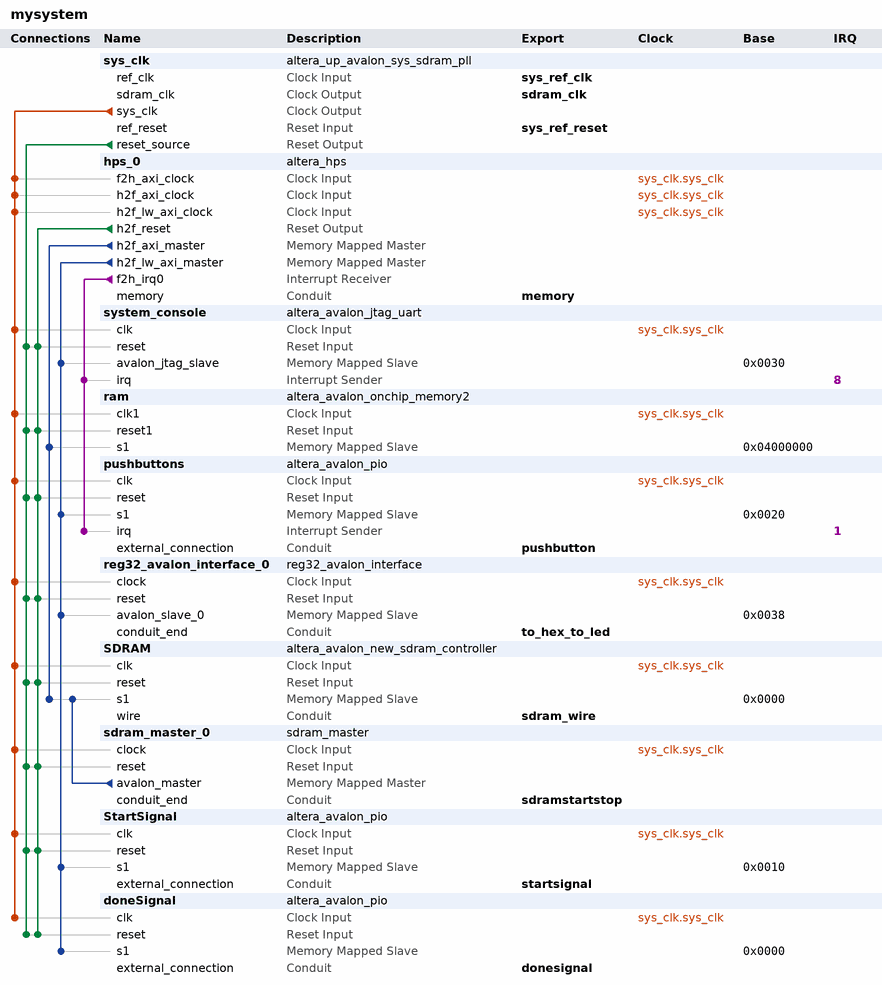
[diagram p0: system contents]
# Platform Designer (Qsys) system mysystem, Cyclone V 5CSEMA5F31C6
# Parameters at their usual value, and those the tool derives, are not listed.
package require -exact qsys 15.0
create_system mysystem
set_project_property DEVICE_FAMILY {Cyclone V}
set_project_property DEVICE 5CSEMA5F31C6

add_instance sys_clk altera_up_avalon_sys_sdram_pll 15.0
set_instance_parameter_value sys_clk CV_boards DE1-SoC
set_instance_parameter_value sys_clk gui_outclk 50.0
set_instance_parameter_value sys_clk gui_refclk 50.0

add_instance hps_0 altera_hps 15.0
set_instance_parameter_value hps_0 EMAC1_Mode N/A
set_instance_parameter_value hps_0 EMAC1_PinMuxing Unused
set_instance_parameter_value hps_0 F2SCLK_COLDRST_Enable false
set_instance_parameter_value hps_0 F2SCLK_DBGRST_Enable false
set_instance_parameter_value hps_0 F2SCLK_WARMRST_Enable false
set_instance_parameter_value hps_0 F2SINTERRUPT_Enable true
set_instance_parameter_value hps_0 F2S_Width 2
set_instance_parameter_value hps_0 FPGA_PERIPHERAL_OUTPUT_CLOCK_FREQ_EMAC0_GTX_CLK 100
set_instance_parameter_value hps_0 FPGA_PERIPHERAL_OUTPUT_CLOCK_FREQ_EMAC0_MD_CLK 2.5
set_instance_parameter_value hps_0 FPGA_PERIPHERAL_OUTPUT_CLOCK_FREQ_EMAC1_GTX_CLK 100
set_instance_parameter_value hps_0 FPGA_PERIPHERAL_OUTPUT_CLOCK_FREQ_EMAC1_MD_CLK 2.5
set_instance_parameter_value hps_0 HPS_PROTOCOL DDR3
set_instance_parameter_value hps_0 I2C0_Mode N/A
set_instance_parameter_value hps_0 I2C0_PinMuxing Unused
set_instance_parameter_value hps_0 I2C1_Mode N/A
set_instance_parameter_value hps_0 I2C1_PinMuxing Unused
set_instance_parameter_value hps_0 LWH2F_Enable true
set_instance_parameter_value hps_0 MEM_BANKADDR_WIDTH 3
set_instance_parameter_value hps_0 MEM_CLK_FREQ 300.0
set_instance_parameter_value hps_0 MEM_CLK_FREQ_MAX 400.0
set_instance_parameter_value hps_0 MEM_COL_ADDR_WIDTH 8
set_instance_parameter_value hps_0 MEM_DQ_WIDTH 8
set_instance_parameter_value hps_0 MEM_DRV_STR RZQ/6
set_instance_parameter_value hps_0 MEM_ROW_ADDR_WIDTH 12
set_instance_parameter_value hps_0 MEM_RTT_NOM RZQ/6
set_instance_parameter_value hps_0 MEM_RTT_WR {Dynamic ODT off}
set_instance_parameter_value hps_0 MEM_TCL 7
set_instance_parameter_value hps_0 MEM_TFAW_NS 37.5
set_instance_parameter_value hps_0 MEM_TINIT_US 499
set_instance_parameter_value hps_0 MEM_TMRD_CK 3
set_instance_parameter_value hps_0 MEM_TRAS_NS 40.0
set_instance_parameter_value hps_0 MEM_TRCD_NS 15.0
set_instance_parameter_value hps_0 MEM_TREFI_US 7.0
set_instance_parameter_value hps_0 MEM_TRFC_NS 75.0
set_instance_parameter_value hps_0 MEM_TRP_NS 15.0
set_instance_parameter_value hps_0 MEM_TWTR 2
set_instance_parameter_value hps_0 MEM_VENDOR JEDEC
set_instance_parameter_value hps_0 MEM_WTCL 6
set_instance_parameter_value hps_0 QSPI_Mode N/A
set_instance_parameter_value hps_0 QSPI_PinMuxing Unused
set_instance_parameter_value hps_0 REF_CLK_FREQ 125.0
set_instance_parameter_value hps_0 S2F_Width 3
set_instance_parameter_value hps_0 SDIO_Mode N/A
set_instance_parameter_value hps_0 SDIO_PinMuxing Unused
set_instance_parameter_value hps_0 SPIM1_Mode N/A
set_instance_parameter_value hps_0 SPIM1_PinMuxing Unused
set_instance_parameter_value hps_0 STM_Enable false
set_instance_parameter_value hps_0 TIMING_BOARD_AC_SKEW 0.02
set_instance_parameter_value hps_0 TIMING_BOARD_AC_TO_CK_SKEW 0.0
set_instance_parameter_value hps_0 TIMING_BOARD_DQ_TO_DQS_SKEW 0.0
set_instance_parameter_value hps_0 TIMING_BOARD_MAX_CK_DELAY 0.6
set_instance_parameter_value hps_0 TIMING_BOARD_MAX_DQS_DELAY 0.6
set_instance_parameter_value hps_0 TIMING_BOARD_SKEW_BETWEEN_DQS 0.02
set_instance_parameter_value hps_0 TIMING_BOARD_SKEW_CKDQS_DIMM_MAX 0.01
set_instance_parameter_value hps_0 TIMING_BOARD_SKEW_CKDQS_DIMM_MIN -0.01
set_instance_parameter_value hps_0 TIMING_BOARD_SKEW_WITHIN_DQS 0.02
set_instance_parameter_value hps_0 TIMING_TDH 125
set_instance_parameter_value hps_0 TIMING_TDQSCK 400
set_instance_parameter_value hps_0 TIMING_TDQSQ 120
set_instance_parameter_value hps_0 TIMING_TDS 50
set_instance_parameter_value hps_0 TIMING_TIH 250
set_instance_parameter_value hps_0 TIMING_TIS 175
set_instance_parameter_value hps_0 TIMING_TQSH 0.38
set_instance_parameter_value hps_0 UART0_Mode N/A
set_instance_parameter_value hps_0 UART0_PinMuxing Unused
set_instance_parameter_value hps_0 USB1_Mode N/A
set_instance_parameter_value hps_0 USB1_PinMuxing Unused
set_instance_parameter_value hps_0 desired_cfg_clk_mhz 100.0
set_instance_parameter_value hps_0 desired_qspi_clk_mhz 400.0

add_instance system_console altera_avalon_jtag_uart 15.0
set_instance_parameter_value system_console simInteractiveOptions NO_INTERACTIVE_WINDOWS

add_instance ram altera_avalon_onchip_memory2 15.0
set_instance_parameter_value ram dataWidth 32
set_instance_parameter_value ram dualPort false
set_instance_parameter_value ram initMemContent true
set_instance_parameter_value ram initializationFileName onchip_mem.hex
set_instance_parameter_value ram memorySize 16384

add_instance pushbuttons altera_avalon_pio 15.0
set_instance_parameter_value pushbuttons bitClearingEdgeCapReg true
set_instance_parameter_value pushbuttons captureEdge true
set_instance_parameter_value pushbuttons direction Input
set_instance_parameter_value pushbuttons edgeType FALLING
set_instance_parameter_value pushbuttons generateIRQ true
set_instance_parameter_value pushbuttons irqType EDGE
set_instance_parameter_value pushbuttons simDoTestBenchWiring true
set_instance_parameter_value pushbuttons width 4

add_instance reg32_avalon_interface_0 reg32_avalon_interface 1.0

add_instance SDRAM altera_avalon_new_sdram_controller 15.0
set_instance_parameter_value SDRAM TAC 5.5
set_instance_parameter_value SDRAM TRCD 20.0
set_instance_parameter_value SDRAM TRP 20.0
set_instance_parameter_value SDRAM casLatency 3
set_instance_parameter_value SDRAM columnWidth 10
set_instance_parameter_value SDRAM dataWidth 16
set_instance_parameter_value SDRAM generateSimulationModel true
set_instance_parameter_value SDRAM model single_Micron_MT48LC4M32B2_7_chip
set_instance_parameter_value SDRAM numberOfBanks 4
set_instance_parameter_value SDRAM numberOfChipSelects 1
set_instance_parameter_value SDRAM powerUpDelay 100.0
set_instance_parameter_value SDRAM refreshPeriod 15.625
set_instance_parameter_value SDRAM rowWidth 13

add_instance sdram_master_0 sdram_master 1.0

add_instance StartSignal altera_avalon_pio 15.0
set_instance_parameter_value StartSignal bitClearingEdgeCapReg true
set_instance_parameter_value StartSignal captureEdge true
set_instance_parameter_value StartSignal direction Output
set_instance_parameter_value StartSignal simDoTestBenchWiring true
set_instance_parameter_value StartSignal width 1

add_instance doneSignal altera_avalon_pio 15.0
set_instance_parameter_value doneSignal bitClearingEdgeCapReg true
set_instance_parameter_value doneSignal captureEdge true
set_instance_parameter_value doneSignal direction Input
set_instance_parameter_value doneSignal edgeType FALLING
set_instance_parameter_value doneSignal irqType EDGE
set_instance_parameter_value doneSignal simDoTestBenchWiring true
set_instance_parameter_value doneSignal width 1

# connections
add_connection sys_clk.sys_clk doneSignal.clk clock
add_connection sys_clk.sys_clk hps_0.f2h_axi_clock clock
add_connection sys_clk.sys_clk hps_0.h2f_axi_clock clock
add_connection sys_clk.sys_clk hps_0.h2f_lw_axi_clock clock
add_connection sys_clk.sys_clk pushbuttons.clk clock
add_connection sys_clk.sys_clk ram.clk1 clock
add_connection sys_clk.sys_clk reg32_avalon_interface_0.clock clock
add_connection sys_clk.sys_clk SDRAM.clk clock
add_connection sys_clk.sys_clk sdram_master_0.clock clock
add_connection sys_clk.sys_clk StartSignal.clk clock
add_connection sys_clk.sys_clk system_console.clk clock
add_connection hps_0.h2f_reset doneSignal.reset reset
add_connection hps_0.h2f_reset pushbuttons.reset reset
add_connection hps_0.h2f_reset ram.reset1 reset
add_connection hps_0.h2f_reset reg32_avalon_interface_0.reset reset
add_connection hps_0.h2f_reset SDRAM.reset reset
add_connection hps_0.h2f_reset sdram_master_0.reset reset
add_connection hps_0.h2f_reset StartSignal.reset reset
add_connection hps_0.h2f_reset system_console.reset reset
add_connection sys_clk.reset_source doneSignal.reset reset
add_connection sys_clk.reset_source pushbuttons.reset reset
add_connection sys_clk.reset_source ram.reset1 reset
add_connection sys_clk.reset_source reg32_avalon_interface_0.reset reset
add_connection sys_clk.reset_source SDRAM.reset reset
add_connection sys_clk.reset_source sdram_master_0.reset reset
add_connection sys_clk.reset_source StartSignal.reset reset
add_connection sys_clk.reset_source system_console.reset reset
add_connection hps_0.h2f_axi_master ram.s1 avalon
set_connection_parameter_value hps_0.h2f_axi_master/ram.s1 baseAddress 0x04000000
add_connection hps_0.h2f_axi_master SDRAM.s1 avalon
set_connection_parameter_value hps_0.h2f_axi_master/SDRAM.s1 baseAddress 0x0000
add_connection hps_0.h2f_lw_axi_master doneSignal.s1 avalon
set_connection_parameter_value hps_0.h2f_lw_axi_master/doneSignal.s1 baseAddress 0x0000
add_connection hps_0.h2f_lw_axi_master pushbuttons.s1 avalon
set_connection_parameter_value hps_0.h2f_lw_axi_master/pushbuttons.s1 baseAddress 0x0020
add_connection hps_0.h2f_lw_axi_master reg32_avalon_interface_0.avalon_slave_0 avalon
set_connection_parameter_value hps_0.h2f_lw_axi_master/reg32_avalon_interface_0.avalon_slave_0 baseAddress 0x0038
add_connection hps_0.h2f_lw_axi_master StartSignal.s1 avalon
set_connection_parameter_value hps_0.h2f_lw_axi_master/StartSignal.s1 baseAddress 0x0010
add_connection hps_0.h2f_lw_axi_master system_console.avalon_jtag_slave avalon
set_connection_parameter_value hps_0.h2f_lw_axi_master/system_console.avalon_jtag_slave baseAddress 0x0030
add_connection sdram_master_0.avalon_master SDRAM.s1 avalon
set_connection_parameter_value sdram_master_0.avalon_master/SDRAM.s1 baseAddress 0x0000
add_connection hps_0.f2h_irq0 pushbuttons.irq interrupt
set_connection_parameter_value hps_0.f2h_irq0/pushbuttons.irq irqNumber 1
add_connection hps_0.f2h_irq0 system_console.irq interrupt
set_connection_parameter_value hps_0.f2h_irq0/system_console.irq irqNumber 8

# exported interfaces
add_interface donesignal conduit end
set_interface_property donesignal EXPORT_OF doneSignal.external_connection
add_interface memory conduit end
set_interface_property memory EXPORT_OF hps_0.memory
add_interface pushbutton conduit end
set_interface_property pushbutton EXPORT_OF pushbuttons.external_connection
add_interface sdram_clk clock source
set_interface_property sdram_clk EXPORT_OF sys_clk.sdram_clk
add_interface sdram_wire conduit end
set_interface_property sdram_wire EXPORT_OF SDRAM.wire
add_interface sdramstartstop conduit end
set_interface_property sdramstartstop EXPORT_OF sdram_master_0.conduit_end
add_interface startsignal conduit end
set_interface_property startsignal EXPORT_OF StartSignal.external_connection
add_interface sys_ref_clk clock sink
set_interface_property sys_ref_clk EXPORT_OF sys_clk.ref_clk
add_interface sys_ref_reset reset sink
set_interface_property sys_ref_reset EXPORT_OF sys_clk.ref_reset
add_interface to_hex_to_led conduit end
set_interface_property to_hex_to_led EXPORT_OF reg32_avalon_interface_0.conduit_end

set_interconnect_requirement {$system} qsys_mm.clockCrossingAdapter HANDSHAKE
set_interconnect_requirement {$system} qsys_mm.enableEccProtection FALSE
set_interconnect_requirement {$system} qsys_mm.insertDefaultSlave FALSE
set_interconnect_requirement {$system} qsys_mm.maxAdditionalLatency 1

save_system mysystem.qsys
